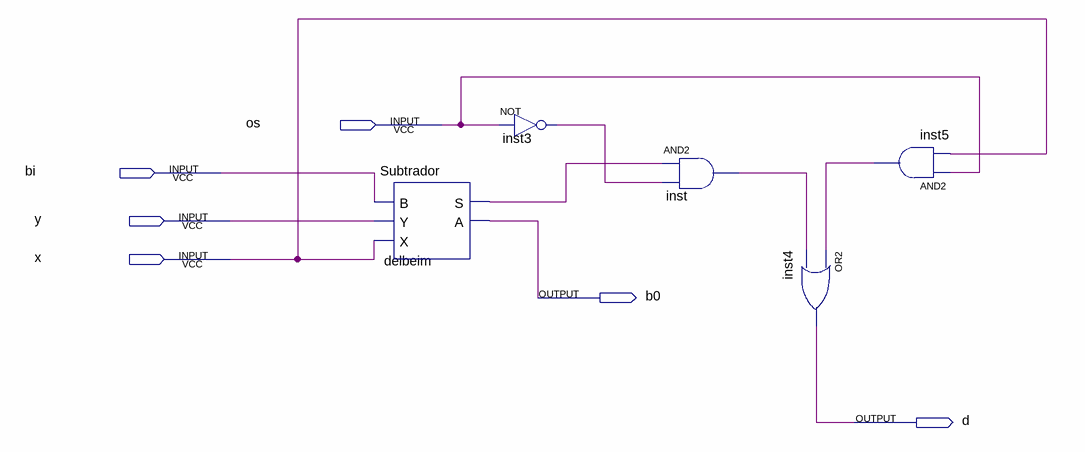
[diagram p0: schematic sheet]
// Quartus schematic unidadedivisao.bdf as structural Verilog: 5 symbols, 6 pins
module unidadedivisao (
  input  os,
  input  bi,
  input  y,
  input  x,
  output b0,
  output d
);

  wire delbeim_s, inst3_out, inst5_out, inst_out;

  Subtrador delbeim (.B(bi), .Y(y), .X(x), .S(delbeim_s), .A(b0));
  not inst3 (inst3_out, os);
  and inst (inst_out, delbeim_s, inst3_out);
  or inst4 (d, inst5_out, inst_out);
  and inst5 (inst5_out, os, x);
endmodule
